# Altium schematic sheet ESP32.SchDoc
size A; SheetNumber: 1; SheetTotal: 3
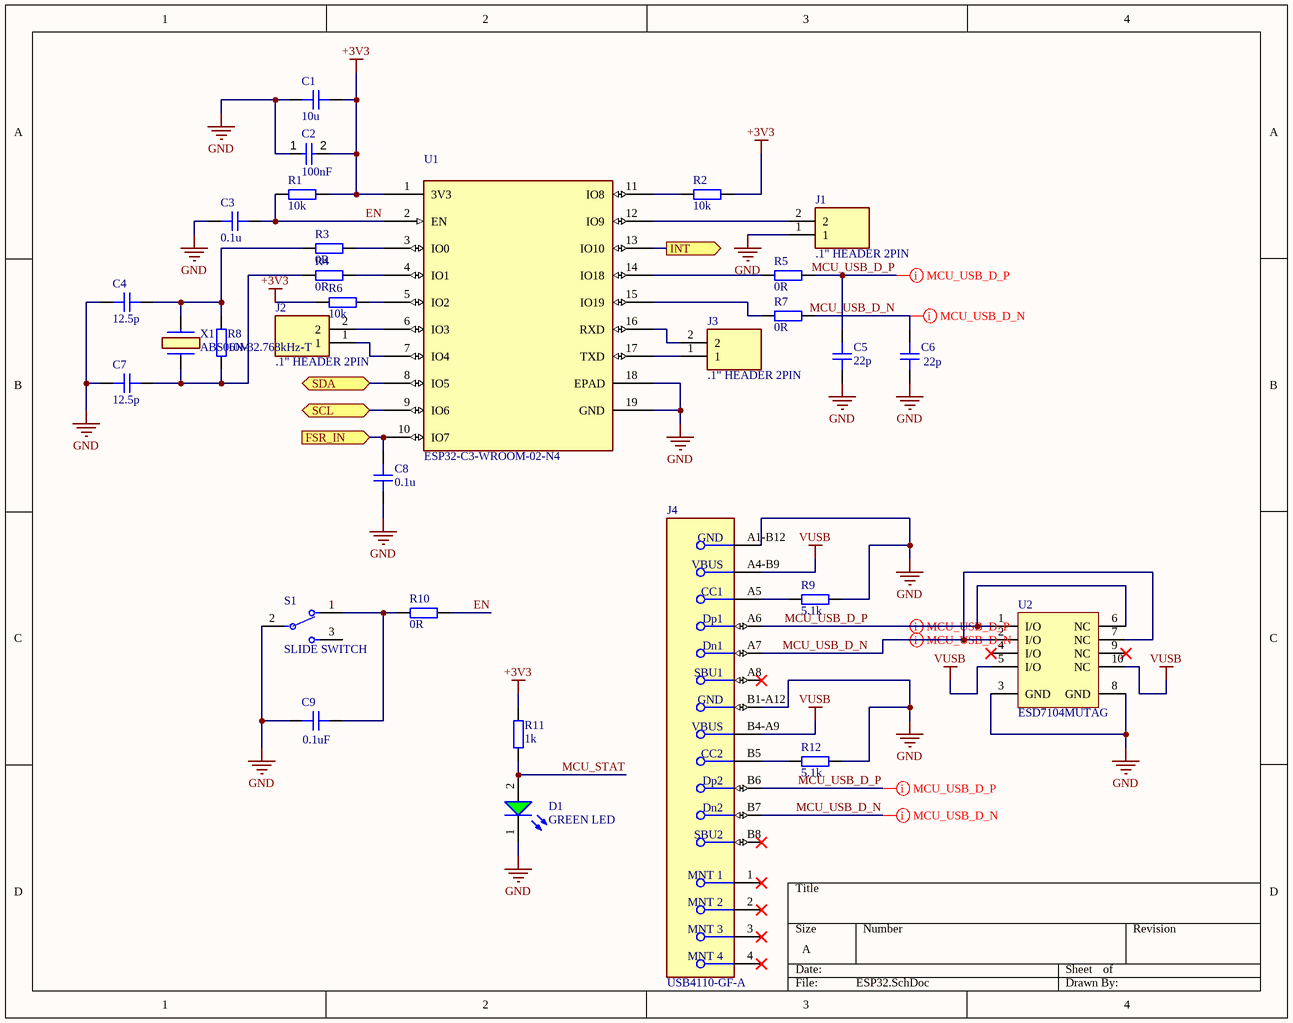
[diagram p0: ESP32.SchDoc]

## Parts
C1  10u  [CAP_0603]
C2  value 100nF  [CAP_0603]  (hidden comment: CAP .1uF)
C3  0.1u  [CAP_0603]
C4  12.5p  [CAP_0603]
C5  22p  [CAP_0603]
C6  22p  [CAP_0603]
C7  12.5p  [CAP_0603]
C8  0.1u  [CAP_0603]
C9  0.1uF  [CAP_0603]
D1  GREEN LED  [WL-SMCW_0603_150060xx75000]
J1  .1" HEADER 2PIN  [HDRV2W64P0X254_1X2_508X250X850P]  (no BOM)
J2  .1" HEADER 2PIN  [HDRV2W64P0X254_1X2_508X250X850P]  (no BOM)
J3  .1" HEADER 2PIN  [HDRV2W64P0X254_1X2_508X250X850P]  (no BOM)
J4  USB4110-GF-A  [FP-USB4110-GF-A-MFG]
R1  10k  [RES_0603]
R2  10k  [RES_0603]
R3  0R  [RES_0603]
R4  0R  [RES_0603]
R5  0R  [RES_0603]
R6  10k  [RES_0603]
R7  0R  [RES_0603]
R8  10M  [RES_0603]
R9  5.1k  [RES_0603]
R10  0R  [RES_0603]
R11  1k  [RES_0603]
R12  5.1k  [RES_0603]
S1  SLIDE SWITCH  [SLW8839352AD]
U1  ESP32-C3-WROOM-02-N4  [MODULE_ESP32-C3-WROOM-02-H4]
U2  ESD7104MUTAG  [ONSC-UDFN-10-517BB-01_V]
X1  ABS06N-32.768kHz-T  [ABS06N32768kHzT]

## Ports
FSR_IN (in, see Sensors[1C]), INT (out, see Sensors[1B]), SCL (bidir, see Sensors[1B]), SDA (bidir, see Sensors[1B])

## Nets
+3V3: C1.2 C2.2 R1.2 R2.2 R6.1 R11.1 U1.1(3V3)
GND: C1.1 C2.1 C3.1 C4.1 C5.1 C6.1 C7.1 C8.1 C9.1 D1.1(K) J1.1 J4.A1-B12(GND) J4.B1-A12(GND) R9.2 R12.2 S1.2(C) U1.18(EPAD) U1.19(GND) U2.3(GND) U2.8(GND)
VUSB: J4.A4-B9(VBUS) J4.B4-A9(VBUS) U2.5(I/O) U2.10(NC)
EN: C3.2 R1.1 R10.2 U1.2(EN)
FSR_IN: C8.2 U1.10(IO7) ; port FSR_IN
INT: U1.13(IO10) ; port INT
MCU_STAT: D1.2(A) R11.2
MCU_USB_D_N: C6.2 J4.A7(Dn1) J4.B7(Dn2) R7.2 U2.2(I/O) U2.7(NC)
MCU_USB_D_P: C5.2 J4.A6(Dp1) J4.B6(Dp2) R5.2 U2.1(I/O) U2.6(NC)
SCL: U1.9(IO6) ; port SCL
SDA: U1.8(IO5) ; port SDA
NetC4_2: C4.2 R3.1 R8.2 X1.2
NetC7_2: C7.2 R4.1 R8.1 X1.1
NetC9_2: C9.2 R10.1 S1.1
NetJ1_2: J1.2 U1.12(IO9)
NetJ2_1: J2.1 U1.7(IO4)
NetJ2_2: J2.2 U1.6(IO3)
NetJ3_1: J3.1 U1.17(TXD)
NetJ3_2: J3.2 U1.16(RXD)
NetJ4_A5: J4.A5(CC1) R9.1
NetJ4_B5: J4.B5(CC2) R12.1
NetR2_1: R2.1 U1.11(IO8)
NetR3_2: R3.2 U1.3(IO0)
NetR4_2: R4.2 U1.4(IO1)
NetR5_1: R5.1 U1.14(IO18)
NetR6_2: R6.2 U1.5(IO2)
NetR7_1: R7.1 U1.15(IO19)

Not connected (* = marked no-connect by the designer): J4 1(MNT_1)* 2(MNT_2)* 3(MNT_3)* 4(MNT_4)* A8(SBU1)* B8(SBU2)*; S1 3; U2 4(I/O)* 9(NC)*

## Layout directives
differential pair: MCU_USB_D_N, MCU_USB_D_P

## Library data of the parts
C1 C3-C9 = CAP_0603: Capacitor SMD 0603; Manufacturer: *; Manufacturer Part Number: *; Distributor Link: *; LCSC: *; Rating: *; Dielectric: *
C2 = CMP-001-00088-1: Capacitor .1uF 10% 16V 0603; Voltage Rating: 16V; Source: Generic_Schematic_Library.SchLib; Design Item ID: CAP .1uF; Tolerance: 10%
D1 = CMP-007-00046-2: Single Color LED, Green, Water Clear, 1.1mm; Forward Current: 30mA; Pins: 2; Mounting Technology: Surface Mount; Max Operating Temperature: 85°C; RoHS Compliant: Yes; Min Operating Temperature: -40°C
J1-J3 = CMP-002-00117-1: Connector; Source: SamacSys.SchLib; Design Item ID: .1" HEADER 2PIN
J4 = CMP-245163-000002-1: CONN USB 2.0 TYPE-C R/A SMT; Manufacturer: GCT; Conn Orientation: Right Angle; Usb Standard: USB 2.0; Voltage Rating: 20V; Current Rating: 3/4.25/1.25/0.25A; Number Of Contacts: 16; Is Female: yes; Shielding: true; Standoff Height: 0.1mm; Octopart: https://octopart.com/usb4110-gf-a-gct-103941985; Temperature: -40°C to +85°C; RoHS: TRUE; Automotive: No; Contact Material: Gold,Nickel; Device Class L1: Connectors; Device Class L2: USB Connectors; Package: 0; Lead Free: Yes; ComponentLink2URL: https://gct.co/files/drawings/usb4110.pdf; Temperature Range High: +85°C; Temperature Range Low: -40°C; Height: 3.46mm; Manufacturer Part Number: USB4110-GF-A; ComponentLink2Description: Datasheet; Device Class L3: unset; Digikey Description: CONN USB 2.0 TYPE-C R/A SMT; Category: Conn
R1-R12 = RES_0603: Resistor SMD 0603; Manufacturer: *; Manufacturer Part Number: *; Distributor Link: *; LCSC: *
S1 = CMP-011-00019-2: Switch; Manufacturer_Name: Same Sky; Manufacturer_Part_Number: SLW-883935-2A-D; Arrow Price/Stock: https://www.arrow.com/en/products/slw-883935-2a-d/cui-devices?utm_currency=USD&region=nac; Arrow Part Number: SLW-883935-2A-D; Datasheet Link: https://www.sameskydevices.com/product/resource/supplyframepdf/slw-883935-2a-d.pdf; Mouser Part Number: 179-SLW-883935-2A-D; Design Item ID: SLW-883935-2A-D; Mouser Price/Stock: https://www.mouser.co.uk/ProductDetail/Same-Sky/SLW-883935-2A-D?qs=1Kr7Jg1SGW%2Fv9j8ky6fn%2FQ%3D%3D; Source: SamacSys.SchLib; Height: 6.1mm
U1 = ESP32-C3-WROOM-02-N4: ESP32 C3-WROOM-02-N4 Module MCU; pin to pad: 3>18 4>17 5>16 6>15 7>3 8>4 9>5 10>6 11>7 12>8 13>10 14>13 15>14 16>11 17>12 18>19 19>9; Manufacturer: Espressif Systems; Manufacturer Part Number: 1965-ESP32-C3-WROOM-02-N4TR-ND
U2 = CMP-1063-00242-1: Transient Voltage Suppressor, Low Capacitance ESD Protection for High Speed Data, 10-Pin UDFN, Pb-Free, Tape and Reel; Manufacturer: On Semiconductor; IR Max (uA): 1; Number of Lines: 4; VRWM Max (V): 5; Direction: Bidirectional; V(BR) Min (V): 5.5; PackageDescription: 10-Pin Small Outline No-Lead, Body 2.5 x 1 mm, Pitch 0.5 mm; ComponentLink3URL: http://www.onsemi.com/pub_link/Collateral/517BB.PDF; PackageReference: UDFN-10-517BB-01; Mounting Technology: Surface Mount; PartNumber: ESD7104MUTAG; ComponentLink1URL: http://www.onsemi.com/; ComponentLink1Description: Manufacturer URL; DatasheetVersion: Rev. 2; ComponentLink2Description: Datasheet; ComponentLink2URL: http://www.onsemi.cn/pub_link/Collateral/ESD7104-D.PDF; PackageVersion: Rev. O, 11/2009; Packing: Tape and Reel; RoHS: Pb-Free; ComponentLink3Description: Package Specification
X1 = ABS06N-32.768kHz-T: 32.768 kHz +/-20ppm Crystal 12.5pF 50 kOhms 2-SMD, No Lead; Manufacturer_Name: ABRACON; Geometry.Height: 0.6mm; Mouser Part Number: *; Mouser Price/Stock: *; Manufacturer_Part_Number: ABS06N-32.768kHz-T; Datasheet Link: https://abracon.com/datasheets/ABS06N.pdf